# EasyEDA Pro project 超级电容组.epro

# Schematic 17.7V超级电容组
Board Name: 17.7V超级电容组; Create Date: 2025-03-22; Page Name: P1; Project Name: 超级电容组（螺丝孔扩大）; Schematic Name: 17.7V超级电容组; Update Date: 2025-04-11; Company: 嘉立创EDA; Page Size: A4; Version: V1.0
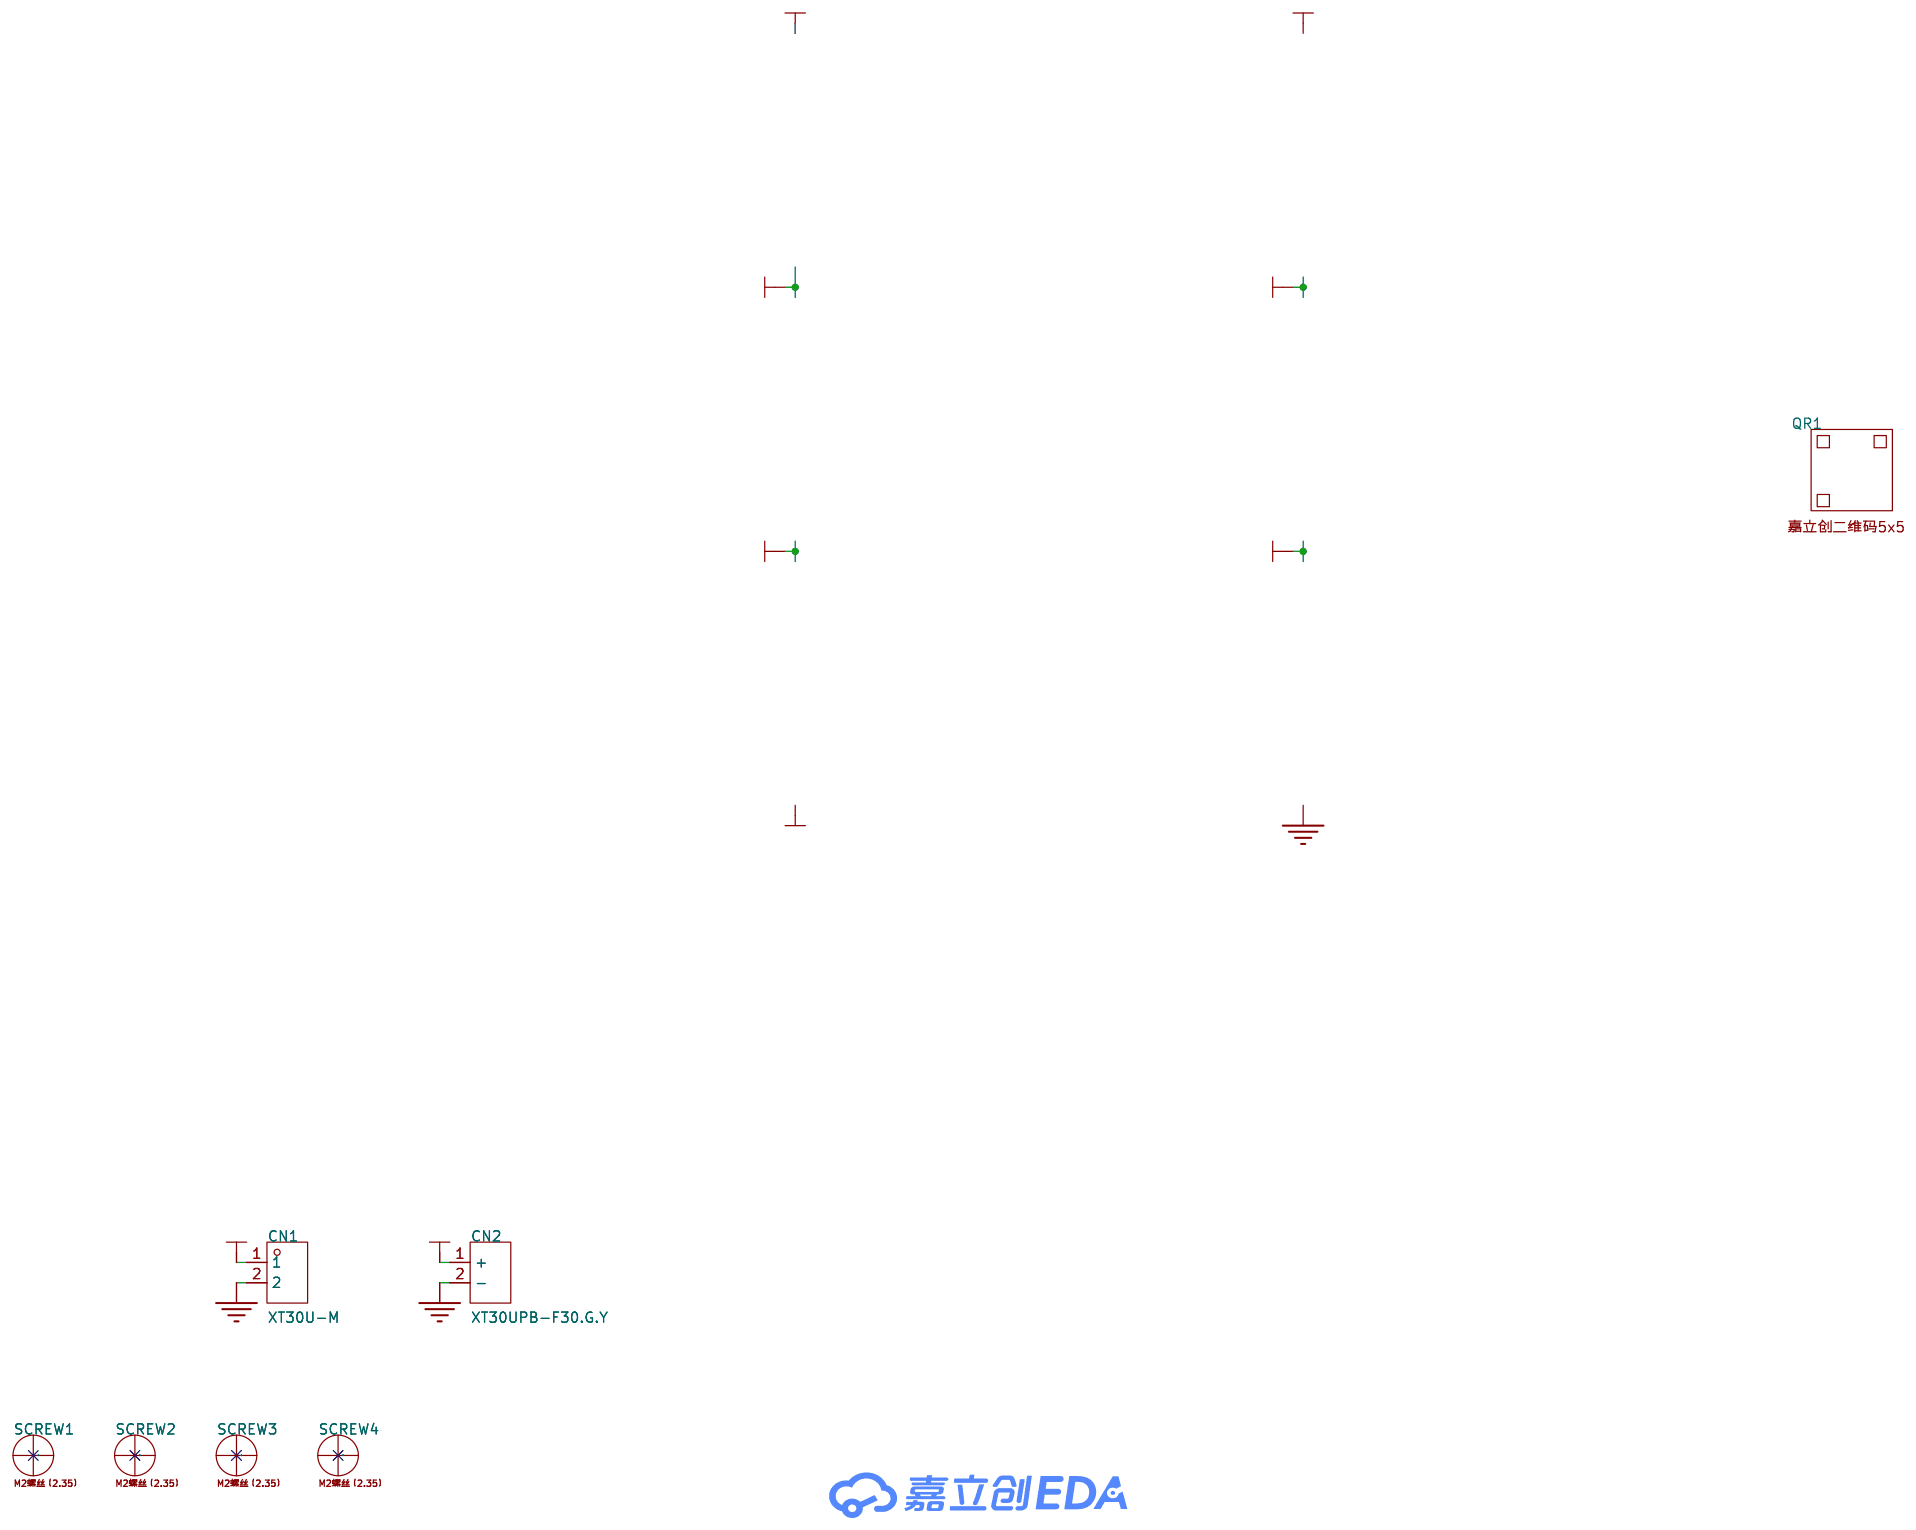
[diagram p0: schematic sheet]

## Parts
CBB1  -
CBB2  -
CBB3  -
CBB4  -
CBB5  -
CBB6  -
CN1  XT30U-M  [CONN-TH_XT30U-M]
CN2  XT30UPB-F30.G.Y  [CONN-TH_XT30UPB-F]
QR1  -  [JLC-QRCODE-5x5]
SCREW1  -  [M2螺丝（2.35）]
SCREW2  -  [M2螺丝（2.35）]
SCREW3  -  [M2螺丝（2.35）]
SCREW4  -  [M2螺丝（2.35）]

## Library data of the parts
CN1 = XT30U-M: 类别:-;类型1:-;; LCSC Part Name: AMASS(艾迈斯)轻量版锂电池插头公头 XT30U-M; Supplier Part: C99101; Manufacturer: AMASS(艾迈斯); Datasheet: https://atta.szlcsc.com/upload/public/pdf/source/20170606/1496716542582.pdf; Supplier: LCSC; Brand: 艾迈斯; Type: 插头; Colour: 黄色; InterfaceType: 公头
CN2 = XT30UPB-F30.G.Y: 类别:-;类型1:-;; LCSC Part Name: AMASS(艾迈斯)直立焊板式连接器XT30UPB30-F.G.*; Supplier Part: C108769; Manufacturer: AMASS(艾迈斯); JLCPCB Part Class: Extended Part; Datasheet: https://atta.szlcsc.com/upload/public/pdf/source/20220715/AFD68B9E8B6CA95A7295DBF4AF9325E4.pdf; Supplier: LCSC; Brand: 艾迈斯; Type: 航模插头; Colour: 黄色; RatedVoltage: DC 500V; InterfaceType: 母头; MetalMaterial: 镀金; InsulationMaterial: PA; RatedCurrent: 15A; contact resistance: 0.65mΩ
QR1 = 嘉立创二维码5x5: Check: false
SCREW1-SCREW4 = M2螺丝（2.35）

## Nets
GND: CBB6.2(GND) CN1.2 CN2.2(-)
VCAP1: CBB1.1(VCAP) CN1.1 CN2.1(+)
VCAP2: CBB1.2(GND) CBB2.1(VCAP)
VCAP3: CBB2.2(GND) CBB3.1(VCAP)
VCAP4: CBB3.2(GND) CBB4.1(VCAP)
VCAP5: CBB4.2(GND) CBB5.1(VCAP)
VCAP6: CBB5.2(GND) CBB6.1(VCAP)

Not connected (* = marked no-connect by the designer): SCREW1 1*; SCREW2 1*; SCREW3 1*; SCREW4 1*

# Schematic 50F-3V超级电容
Board Name: 50F-3V超级电容; Create Date: 2025-03-31; Page Name: P1; Project Name: 50F-3V超级电容; Schematic Name: 50F-3V超级电容; Update Date: 2025-03-31; Company: 嘉立创EDA; Page Size: A4; Version: V1.0
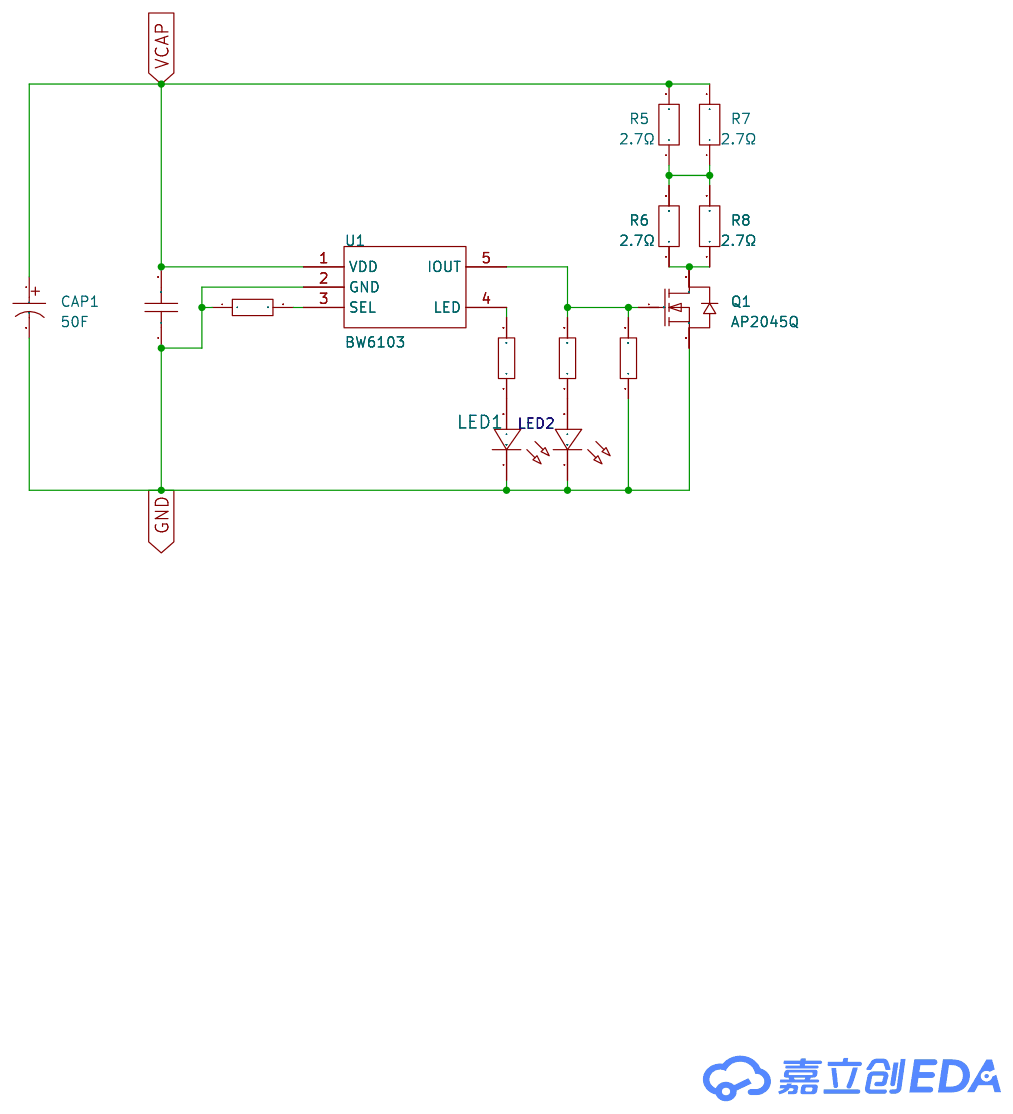
[diagram p1: schematic sheet]

## Parts
C1  1uF  [C0603]
CAP1  50F  [CAP-TH_BD18.0-P7.50-D1.2-FD]
LED1  XL-1608SURC-06  [LED_0603]
LED2  XL-1608UBC-04  [LED_0603]
Q1  AP2045Q  [DFN-8_L3.1-W3.0-P0.65-LS3.3-BL]
R1  1kΩ  [R0603]
R2  1kΩ  [R0603]
R3  1kΩ  [R0603]
R4  1kΩ  [R0603]
R5  2.7Ω  [R1206]
R6  2.7Ω  [R1206]
R7  2.7Ω  [R1206]
R8  2.7Ω  [R1206]
U1  BW6103  [SOT23-5]

## Library data of the parts
C1 = CL10A105KB8NNNC: 容值:1uF;精度:±10%;额定电压:50V;材质(温度系数):X5R;; LCSC Part Name: 1uF ±10% 50V; Supplier Part: C15849; Manufacturer: SAMSUNG(三星); Supplier Footprint: 0603; JLCPCB Part Class: Basic Part; Datasheet: https://atta.szlcsc.com/upload/public/pdf/source/20160218/1457707763339.pdf; Supplier: LCSC; Tolerance: ±10%; Voltage Rated: 50V; Temperature Coefficient: X5R
CAP1 = CXP-3R0506R-TW 3.0V50F: 容值:50F;精度:-10%~+30%;额定电压:3V;漏电流:75uA@72hrs;等效串联电阻(ESR):18mΩ@1kHz;; LCSC Part Name: 50F -10%~+30% 3V; Supplier Part: C2925898; Manufacturer: CDA(智烽维); Supplier Footprint: 插件,P=7.5mm; JLCPCB Part Class: Extended Part; Datasheet: https://atta.szlcsc.com/upload/public/pdf/source/20210903/44453F82BFAAA05FE6CCD2EFE8CDD582.pdf; Supplier: LCSC; Tolerance: -10%~+30%; Voltage Rating: 3V; Current - Leakage: 75uA@72hrs; Equivalent Series Resistance(ESR): 18mΩ@1kHz; Lifetime: 1000hrs@65℃; Operating Temperature: -40℃~+65℃; Diameter: 18mm; Height - Seated(Max): 40mm; Check: false
LED1 = XL-1608SURC-06: 灯头类型:-;发光颜色:红色;正向压降(Vf):2.3V;功率:50mW;正向电流:20mA;波长:620nm~630nm;二极管配置:-;透镜颜色:无色透明透镜;色温:-;发光强度:225mcd;发光角度:120°;载带方式:正贴;工作温度:-20℃~+85℃;; Supplier Part: C965799; Manufacturer: XINGLIGHT(成兴光); Supplier Footprint: 0603; JLCPCB Part Class: Extended Part; Datasheet: https://atta.szlcsc.com/upload/public/pdf/source/20250213/F9766CE804AF391355DCDD48DB3E0DAB.pdf; Supplier: LCSC; Illumination Color: 红色; Voltage - Forward(Vf): 2.3V; Power(Watts): 50mW; Forward Current: 20mA; Wavelength - Dominant: 620nm~630nm; Peak Wavelength: 625nm; Lens Color: 无色透明透镜; Luminous Intensity: 225mcd; Viewing Angle: 120°; Mounting Sytle: 正贴; Operating Temperature: -20℃~+85℃; Check: false
LED2 = XL-1608UBC-04: 灯头类型:-;发光颜色:蓝色;正向压降(Vf):3.3V;功率:70mW;正向电流:20mA;波长:455nm~475nm;二极管配置:-;透镜颜色:无色透明透镜;色温:-;发光强度:300mcd;发光角度:120°;载带方式:正贴;工作温度:-20℃~+85℃;; Supplier Part: C965807; Manufacturer: XINGLIGHT(成兴光); Supplier Footprint: 0603; JLCPCB Part Class: Extended Part; Datasheet: https://atta.szlcsc.com/upload/public/pdf/source/20250213/9D28F40E58C3285D8CA3C7212E2FBA3B.pdf; Supplier: LCSC; Illumination Color: 蓝色; Voltage - Forward(Vf): 3.3V; Power(Watts): 70mW; Forward Current: 20mA; Wavelength - Dominant: 455nm~475nm; Peak Wavelength: 470nm; Lens Color: 无色透明透镜; Luminous Intensity: 300mcd; Viewing Angle: 120°; Mounting Sytle: 正贴; Operating Temperature: -20℃~+85℃; Check: false
Q1 = AP2045Q: 类型:1个N沟道;漏源电压(Vdss):20V;连续漏极电流(Id):65A;导通电阻(RDS(on)@Vgs,Id):4.6mΩ@4.5V,20A;功率(Pd):35W;阈值电压(Vgs(th)@Id):600mV@1mA;; LCSC Part Name: N沟道,电流:65A,耐压:20V; Supplier Part: C2828594; Manufacturer: ALLPOWER(铨力); Supplier Footprint: DFN-8(3x3.1); Datasheet: https://atta.szlcsc.com/upload/public/pdf/source/20210507/C2828594_9C6148FF592D5F86F0D42008EBC9C631.pdf; Supplier: LCSC; Type: 1个N沟道; Drain Source Voltage (Vdss): 20V; Continuous Drain Current (Id): 65A; Drain Source On Resistance (RDS(on)@Vgs,Id): 4.6mΩ@4.5V,20A; Power Dissipation (Pd): 35W; Gate Threshold Voltage (Vgs(th)@Id): 600mV@1mA; Total Gate Charge (Qg@Vgs): 99.2nC; Input Capacitance (Ciss@Vds): 4.4nF; Reverse Transfer Capacitance (Crss@Vds): 400pF; Operating Temperature: -55℃~+150℃
R1-R4 = RC0603FR-071KL: 电阻类型:厚膜电阻;阻值:1kΩ;精度:±1%;功率:100mW;最大工作电压:75V;温度系数:±100ppm/℃;; LCSC Part Name: 厚膜电阻 1kΩ ±1% 100mW; Supplier Part: C22548; Manufacturer: YAGEO(国巨); Supplier Footprint: 0603; JLCPCB Part Class: Extended Part; Datasheet: https://atta.szlcsc.com/upload/public/pdf/source/20180316/70C0E2BDAE7FCC62C531A5A58D202EE1.pdf; Supplier: LCSC; Type: 厚膜电阻; Tolerance: ±1%; Power(Watts): 100mW; Overload Voltage (Max): 75V; Temperature Coefficient: ±100ppm/℃; Operating Temperature Range: -55℃~+155℃
R5-R8 = MFCR1206F2R70QHR: 电阻类型:薄膜电阻;阻值:2.7Ω;精度:±1%;工作电压:-;功率:1W;温度系数:±50ppm/℃;安装方式:贴片;; LCSC Part Name: 低阻薄膜采样电阻 2.7Ω ±1% 1W; Supplier Part: C42415573; Manufacturer: RESI(开步睿思); Supplier Footprint: 1206; Datasheet: https://atta.szlcsc.com/upload/public/pdf/source/20241216/C01C5DE37DA5B92A06CD9B33FDEFCA12.pdf; Supplier: LCSC; Type: 薄膜电阻; Tolerance: ±1%; Power(Watts): 1W; Temperature Coefficient: ±50ppm/℃; Mounting Type: 贴片
U1 = BW6101: Pin Type: IN; Check: false

## Nets
GND: C1.1 CAP1.2 LED1.1(C) LED2.1(C) Q1.1(S) Q1.2(S) Q1.3(S) R1.1 R4.1 U1.2(GND)
VCAP: C1.2 CAP1.1 R5.2 R7.2 U1.1(VDD)
$1N683: R1.2 U1.3(SEL)
$1N684: R2.2 U1.4(LED)
$1N687: LED1.2(A) R2.1
$1N688: LED2.2(A) R3.1
$1N689: Q1.4(G) R3.2 R4.2 U1.5(IOUT)
$1N690: R5.1 R6.2 R7.1 R8.2
$1N691: Q1.5(D) Q1.6(D) Q1.7(D) Q1.8(D) R6.1 R8.1

# Board 50F-3V超级电容
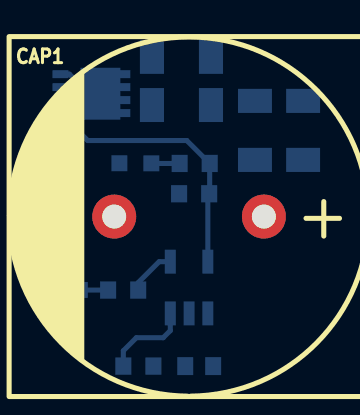
[diagram p2: board, top side]
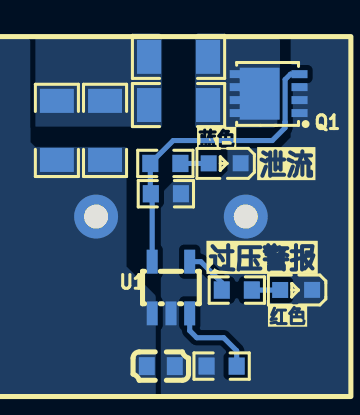
[diagram p3: board, bottom side, seen from below]

No outline. copper layers: Top Layer, Bottom Layer. Coordinates in mm from the lowest, leftmost part position.
Stack: Top Layer 0.035mm / Dielectric1 1.51mm FR4 er 4.5 / Bottom Layer 0.035mm

## Design rules (mm)
template: xyf_v1.1
spacing copperThickness1oz (default): track to track 0.102, other pairs 0.152 to 0.3
spacing copperThickness2oz: track to track 0.203, other pairs 0.152 to 0.3
spacing 0焊盘板框间距: track to track 0.152, other pairs 0 to 0.3
spacing copperThicknessInner0.5oz: track to track 0.089, other pairs 0.152 to 0.3
track width copperThickness1oz (default): min 0.127, default 0.254, max 2.54
track width copperThickness2oz: min 0.203, default 0.254, max 2.54
track width copperThickness0.5oz: min 0.089, default 0.254, max 2.54
differential pair differentialPair (default): width min 0.127, default 0.254, max 2.54; gap min 0.152, default 0.152
via viaSize (default): diameter min 0.5, default 0.61, max 10; hole min 0.3, default 0.305, max 6.3
via viaSize2: diameter min 0.5, default 0.61, max 10; hole min 0.3, default 0.305, max 6.299
via viaSize4: diameter min 0.45, default 0.61, max 10; hole min 0.3, default 0.305, max 6.299

## Placement (name value [footprint] x y rotation side)
C1  1uF  [C0603]  6.73 0 0 bottom
CAP1  50F  [CAP-TH_BD18.0-P7.50-D1.2-FD]  6.22 7.49 180 top
LED1  XL-1608SURC-06  [LED_0603]  0 3.81 0 bottom
LED2  XL-1608UBC-04  [LED_0603]  3.58 10.16 0 bottom
Q1  AP2045Q  [DFN-8_L3.1-W3.0-P0.65-LS3.3-BL]  1.33 13.65 90 bottom
R1  1kΩ  [R0603]  3.68 0 180 bottom
R2  1kΩ  [R0603]  2.92 3.81 0 bottom
R3  1kΩ  [R0603]  6.5 10.16 0 bottom
R4  1kΩ  [R0603]  6.48 8.64 0 bottom
R5  2.7Ω  [R1206]  9.53 11.81 270 bottom
R6  2.7Ω  [R1206]  5.84 13.08 0 bottom
R7  2.7Ω  [R1206]  11.94 11.81 270 bottom
R8  2.7Ω  [R1206]  5.84 15.49 0 bottom
U1  BW6103  [SOT23-5]  6.22 3.94 180 bottom

## Footprints (pads in the part's own frame, mm; a bottom-side part is the same pattern mirrored in y, then rotated)
C0603
  rect 0.8x0.9 smd: 1(-0.7,0) 2(0.7,0)
CAP-TH_BD18.0-P7.50-D1.2-FD
  round 2.2 hole 1.2: 1(-3.75,0) 2(3.75,0)
DFN-8_L3.1-W3.0-P0.65-LS3.3-BL
  rect 0.4x0.8 smd: 1(-0.975,-1.55) 2(-0.325,-1.55) 3(0.326,-1.55) 4(0.975,-1.55) 5(0.975,1.55) 6(0.325,1.55) 7(-0.325,1.55) 8(-0.975,1.55)
  rect 2.6x2 smd: 8(-0.004,0.45)
LED_0603
  rect 0.8x0.8 smd: 1(-0.851,-0.01) 2(0.75,-0.005)
R0603
  rect 0.806x0.864 smd: 1(-0.753,0) 2(0.753,0)
R1206
  rect 1.208x1.701 smd: 1(-1.479,0) 2(1.479,0)
SOT23-5
  rect 0.551x1.199 smd: 1(-0.94,-1.296) 2(0,-1.296) 3(0.94,-1.296) 4(0.94,1.296) 5(-0.94,1.296)

## Nets
As in the schematic.

## Routing (per net, layer and track width the routed paths; a pad name or vN(x,y) marks a point on that pad's centre or on a via; arc(x,y) is an arc through that point)
$1N683: length 4.4
  Bottom Layer w0.254: R1.2 2.93,0.77 3.58,1.42 4.93,1.42 5.28,1.78 U1.3
$1N684: length 2.4
  Bottom Layer w0.254: R2.2 3.67,4.18 4.72,5.23 U1.4
$1N687: length 1.4
  Bottom Layer w0.254: R2.1 0.75,3.81 LED1.2
$1N688: length 1.4
  Bottom Layer w0.254: R3.1 4.34,10.16 LED2.2
$1N689: length 15.7
  Bottom Layer w0.254: Q1.4 0.23,14.63 0.5,14.36 0.5,12.23 0.51,12.23 0.51,11.94 1.14,11.3 6.11,11.3 7.26,10.16 7.26,8.66 R4.2 7.16,8.57 U1.5

## Copper pours and planes (outline as drawn; the poured copper is in the pictures)
GND on Bottom Layer: 6.73,8.63 6.73,-1.47 -2.79,-1.47 -2.79,16.48 0.23,16.48 0.23,11.46 0.76,10.92 3.39,10.92 3.39,9.79 3.77,9.41 5.96,9.41
VCAP on Bottom Layer: 8.45,10.99 13.02,10.99 13.26,11.23 13.26,16.38 15.24,16.38 15.24,-1.52 6.99,-1.52 6.99,3.53 8.45,4.99
$1N690 on Bottom Layer: 6.67,16.45 13.02,16.45 13.02,12 6.67,12
$1N691 on Bottom Layer: 0.76,16.45 5.02,16.45 5.02,11.94 0.76,11.94

## Text on the board
Bottom Silkscreen Layer: 红色 | 蓝色 | 泄流 | 过压警报

# Board 17.7V超级电容组
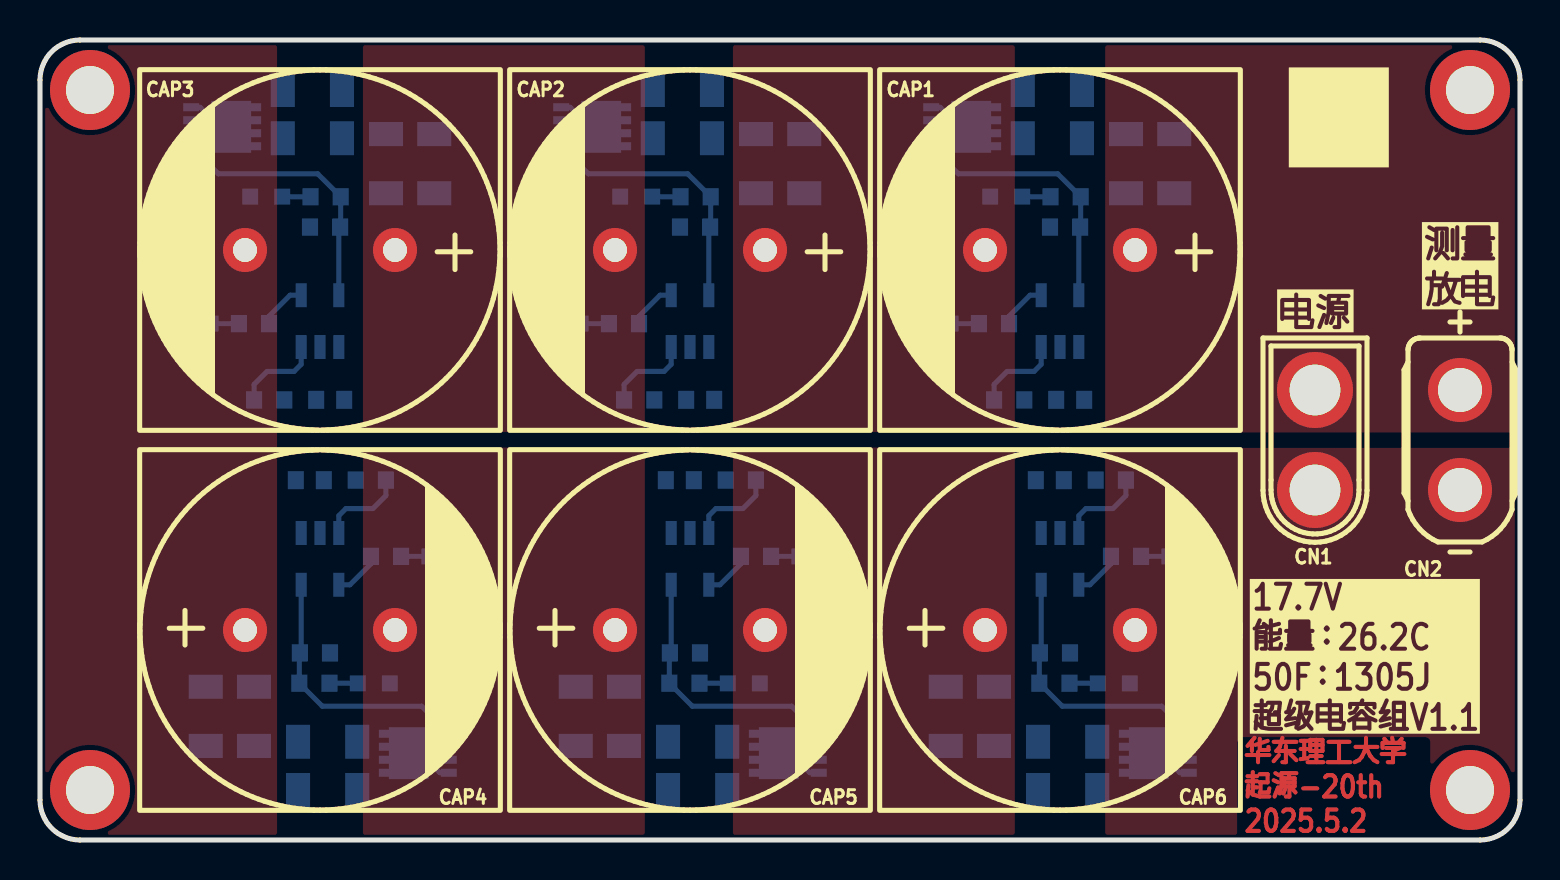
[diagram p4: board, top side]
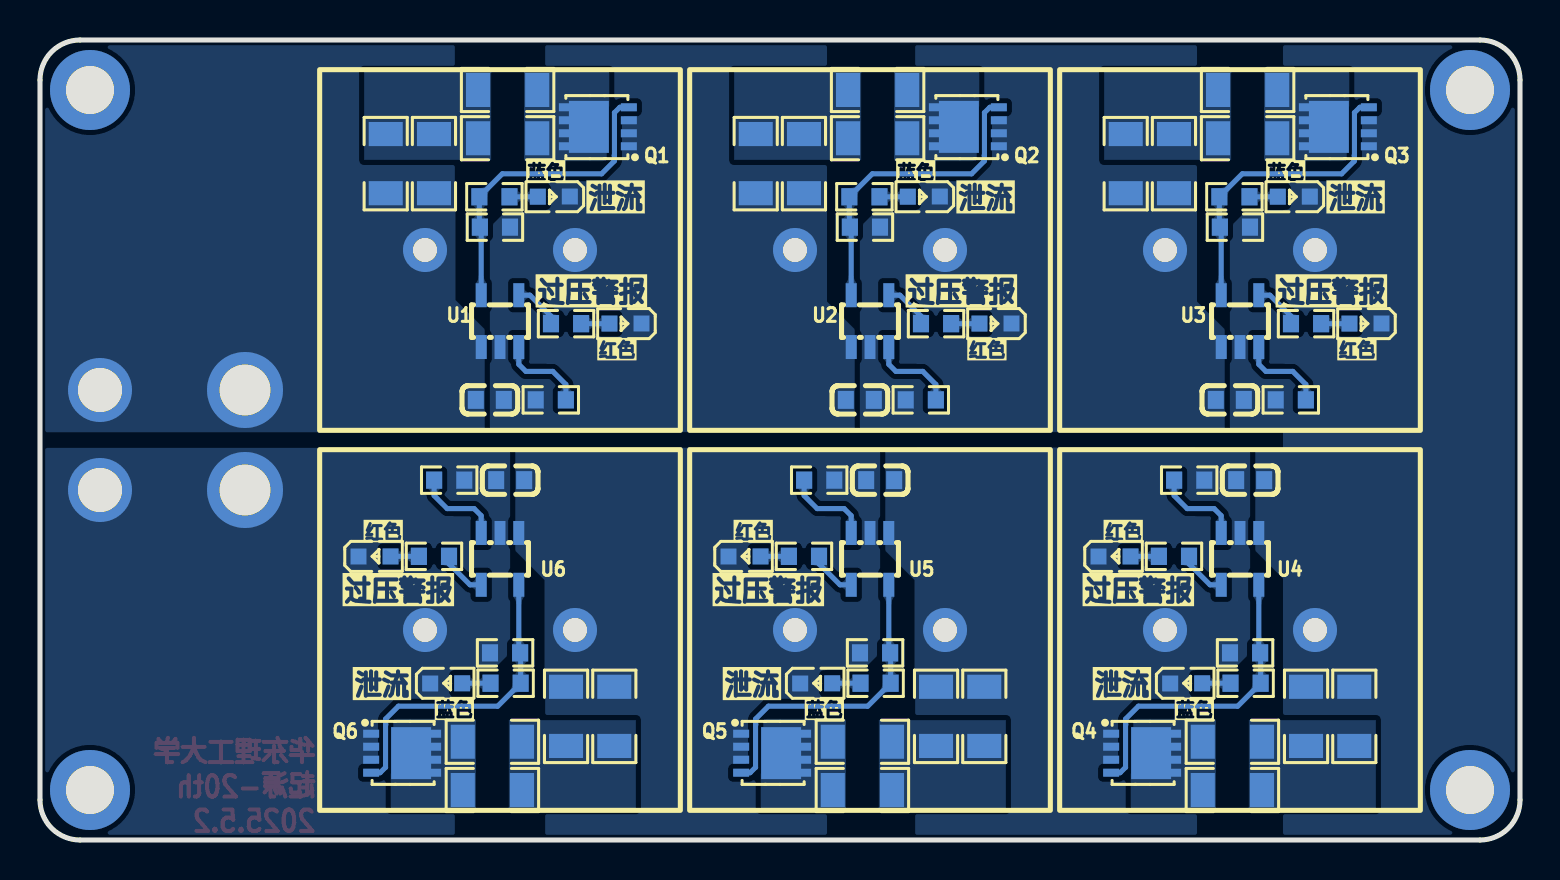
[diagram p5: board, bottom side, seen from below]

Outline 74 x 40 mm; copper layers: Top Layer, Bottom Layer. Coordinates in mm from the lower left corner of the outline.
Outline path: 0,38 0,2 arc(0.59,0.59) 2,0 72,0 arc(73.41,0.59) 74,2 74,38 arc(73.41,39.41) 72,40 2,40 arc(0.59,39.41) 0,38
Stack: Top Layer 0.035mm / Dielectric1 1.51mm FR4 er 4.5 / Bottom Layer 0.035mm

## Design rules (mm)
template: xyf_v1.1
spacing copperThickness1oz (default): track to track 0.102, other pairs 0.152 to 0.3
spacing copperThickness2oz: track to track 0.203, other pairs 0.152 to 0.3
spacing 0焊盘板框间距: track to track 0.152, other pairs 0 to 0.3
spacing copperThicknessInner0.5oz: track to track 0.089, other pairs 0.152 to 0.3
track width copperThickness1oz (default): min 0.127, default 0.254, max 2.54
track width copperThickness2oz: min 0.203, default 0.254, max 2.54
track width copperThickness0.5oz: min 0.089, default 0.254, max 2.54
differential pair differentialPair (default): width min 0.127, default 0.254, max 2.54; gap min 0.152, default 0.152
via viaSize (default): diameter min 0.5, default 0.61, max 10; hole min 0.3, default 0.305, max 6.3
via viaSize2: diameter min 0.5, default 0.61, max 10; hole min 0.3, default 0.305, max 6.299
via viaSize4: diameter min 0.45, default 0.61, max 10; hole min 0.3, default 0.305, max 6.299

## Placement (name value [footprint] x y rotation side)
C1  1uF  [C0603]  51.51 22.01 0 bottom
C2  1uF  [C0603]  33.01 22.01 0 bottom
C3  1uF  [C0603]  14.51 22.01 0 bottom
C4  1uF  [C0603]  13.49 17.99 180 bottom
C5  1uF  [C0603]  31.99 17.99 180 bottom
C6  1uF  [C0603]  50.49 17.99 180 bottom
CAP1  50F  [CAP-TH_BD18.0-P7.50-D1.2-FD]  51 29.5 180 top
CAP2  50F  [CAP-TH_BD18.0-P7.50-D1.2-FD]  32.5 29.5 180 top
CAP3  50F  [CAP-TH_BD18.0-P7.50-D1.2-FD]  14 29.5 180 top
CAP4  50F  [CAP-TH_BD18.0-P7.50-D1.2-FD]  14 10.5 0 top
CAP5  50F  [CAP-TH_BD18.0-P7.50-D1.2-FD]  32.5 10.5 0 top
CAP6  50F  [CAP-TH_BD18.0-P7.50-D1.2-FD]  51 10.5 0 top
CN1  XT30U-M  [CONN-TH_XT30U-M]  63.75 20 270 top
CN2  XT30UPB-F30.G.Y  [CONN-TH_XT30UPB-F]  71 20 270 top
LED1  XL-1608SURC-06  [LED_0603]  44.78 25.82 0 bottom
LED2  XL-1608UBC-04  [LED_0603]  48.36 32.16 0 bottom
LED3  XL-1608SURC-06  [LED_0603]  26.28 25.82 0 bottom
LED4  XL-1608UBC-04  [LED_0603]  29.86 32.16 0 bottom
LED5  XL-1608SURC-06  [LED_0603]  7.78 25.82 0 bottom
LED6  XL-1608UBC-04  [LED_0603]  11.36 32.16 0 bottom
LED7  XL-1608SURC-06  [LED_0603]  20.22 14.18 180 bottom
LED8  XL-1608UBC-04  [LED_0603]  16.64 7.84 180 bottom
LED9  XL-1608SURC-06  [LED_0603]  38.72 14.18 180 bottom
LED10  XL-1608UBC-04  [LED_0603]  35.14 7.84 180 bottom
LED11  XL-1608SURC-06  [LED_0603]  57.22 14.18 180 bottom
LED12  XL-1608UBC-04  [LED_0603]  53.64 7.84 180 bottom
Q1  AP2045Q  [DFN-8_L3.1-W3.0-P0.65-LS3.3-BL]  46.11 35.66 90 bottom
Q2  AP2045Q  [DFN-8_L3.1-W3.0-P0.65-LS3.3-BL]  27.61 35.66 90 bottom
Q3  AP2045Q  [DFN-8_L3.1-W3.0-P0.65-LS3.3-BL]  9.11 35.66 90 bottom
Q4  AP2045Q  [DFN-8_L3.1-W3.0-P0.65-LS3.3-BL]  18.89 4.34 270 bottom
Q5  AP2045Q  [DFN-8_L3.1-W3.0-P0.65-LS3.3-BL]  37.39 4.34 270 bottom
Q6  AP2045Q  [DFN-8_L3.1-W3.0-P0.65-LS3.3-BL]  55.89 4.34 270 bottom
QR1  -  [JLC-QRCODE-5x5]  64.94 36.13 0 top
R1  1kΩ  [R0603]  48.46 22.01 180 bottom
R2  1kΩ  [R0603]  47.7 25.82 0 bottom
R3  1kΩ  [R0603]  51.28 32.16 0 bottom
R4  1kΩ  [R0603]  51.25 30.64 0 bottom
R5  2.7Ω  [R1206]  54.3 33.82 270 bottom
R6  2.7Ω  [R1206]  50.62 35.09 0 bottom
R7  2.7Ω  [R1206]  56.72 33.82 270 bottom
R8  2.7Ω  [R1206]  50.62 37.5 0 bottom
R9  1kΩ  [R0603]  29.96 22.01 180 bottom
R10  1kΩ  [R0603]  29.2 25.82 0 bottom
R11  1kΩ  [R0603]  32.78 32.16 0 bottom
R12  1kΩ  [R0603]  32.75 30.64 0 bottom
R13  2.7Ω  [R1206]  35.8 33.82 270 bottom
R14  2.7Ω  [R1206]  32.12 35.09 0 bottom
R15  2.7Ω  [R1206]  38.22 33.82 270 bottom
R16  2.7Ω  [R1206]  32.12 37.5 0 bottom
R17  1kΩ  [R0603]  11.46 22.01 180 bottom
R18  1kΩ  [R0603]  10.7 25.82 0 bottom
R19  1kΩ  [R0603]  14.28 32.16 0 bottom
R20  1kΩ  [R0603]  14.25 30.64 0 bottom
R21  2.7Ω  [R1206]  17.3 33.82 270 bottom
R22  2.7Ω  [R1206]  13.62 35.09 0 bottom
R23  2.7Ω  [R1206]  19.72 33.82 270 bottom
R24  2.7Ω  [R1206]  13.62 37.5 0 bottom
R25  1kΩ  [R0603]  16.54 17.99 0 bottom
R26  1kΩ  [R0603]  17.3 14.18 180 bottom
R27  1kΩ  [R0603]  13.72 7.84 180 bottom
R28  1kΩ  [R0603]  13.75 9.36 180 bottom
R29  2.7Ω  [R1206]  10.7 6.18 90 bottom
R30  2.7Ω  [R1206]  14.38 4.91 180 bottom
R31  2.7Ω  [R1206]  8.28 6.18 90 bottom
R32  2.7Ω  [R1206]  14.38 2.5 180 bottom
R33  1kΩ  [R0603]  35.04 17.99 0 bottom
R34  1kΩ  [R0603]  35.8 14.18 180 bottom
R35  1kΩ  [R0603]  32.22 7.84 180 bottom
R36  1kΩ  [R0603]  32.25 9.36 180 bottom
R37  2.7Ω  [R1206]  29.2 6.18 90 bottom
R38  2.7Ω  [R1206]  32.88 4.91 180 bottom
R39  2.7Ω  [R1206]  26.78 6.18 90 bottom
R40  2.7Ω  [R1206]  32.88 2.5 180 bottom
R41  1kΩ  [R0603]  53.54 17.99 0 bottom
R42  1kΩ  [R0603]  54.3 14.18 180 bottom
R43  1kΩ  [R0603]  50.72 7.84 180 bottom
R44  1kΩ  [R0603]  50.75 9.36 180 bottom
R45  2.7Ω  [R1206]  47.7 6.18 90 bottom
R46  2.7Ω  [R1206]  51.38 4.91 180 bottom
R47  2.7Ω  [R1206]  45.28 6.18 90 bottom
R48  2.7Ω  [R1206]  51.38 2.5 180 bottom
SCREW1  -  [M2螺丝（2.35）]  2.5 37.5 0 top
SCREW2  -  [M2螺丝（2.35）]  71.5 37.5 0 top
SCREW3  -  [M2螺丝（2.35）]  2.5 2.5 0 top
SCREW4  -  [M2螺丝（2.35）]  71.5 2.5 0 top
U1  BW6103  [SOT23-5]  51 25.94 180 bottom
U2  BW6103  [SOT23-5]  32.5 25.94 180 bottom
U3  BW6103  [SOT23-5]  14 25.94 180 bottom
U4  BW6103  [SOT23-5]  14 14.06 0 bottom
U5  BW6103  [SOT23-5]  32.5 14.06 0 bottom
U6  BW6103  [SOT23-5]  51 14.06 0 bottom

## Footprints (pads in the part's own frame, mm; a bottom-side part is the same pattern mirrored in y, then rotated)
C0603
  rect 0.8x0.9 smd: 1(-0.7,0) 2(0.7,0)
CAP-TH_BD18.0-P7.50-D1.2-FD
  round 2.2 hole 1.2: 1(-3.75,0) 2(3.75,0)
CONN-TH_XT30U-M
  round 3.8 hole 2.54: 1(-2.5,0) 2(2.5,0)
CONN-TH_XT30UPB-F
  round 3.2 hole 2.2: 1(-2.5,0) 2(2.5,0)
DFN-8_L3.1-W3.0-P0.65-LS3.3-BL
  rect 0.4x0.8 smd: 1(-0.975,-1.55) 2(-0.325,-1.55) 3(0.326,-1.55) 4(0.975,-1.55) 5(0.975,1.55) 6(0.325,1.55) 7(-0.325,1.55) 8(-0.975,1.55)
  rect 2.6x2 smd: 8(-0.004,0.45)
LED_0603
  rect 0.8x0.8 smd: 1(-0.851,-0.01) 2(0.75,-0.005)
M2螺丝（2.35）
  round 4 hole 2.4x2.35: 1(0,0)
R0603
  rect 0.806x0.864 smd: 1(-0.753,0) 2(0.753,0)
R1206
  rect 1.208x1.701 smd: 1(-1.479,0) 2(1.479,0)
SOT23-5
  rect 0.551x1.199 smd: 1(-0.94,-1.296) 2(0,-1.296) 3(0.94,-1.296) 4(0.94,1.296) 5(-0.94,1.296)

## Nets
GND: C6.1 CAP6.2 CN1.2 CN2.2 LED11.1 LED12.1 Q6.1 Q6.2 Q6.3 R41.1 R44.1 U6.2
$1I13637\$1N683: R1.2 U1.3
$1I13637\$1N684: R2.2 U1.4
$1I13637\$1N687: LED1.2 R2.1
$1I13637\$1N688: LED2.2 R3.1
$1I13637\$1N689: Q1.4 R3.2 R4.2 U1.5
$1I13637\$1N690: R5.1 R6.2 R7.1 R8.2
$1I13637\$1N691: Q1.5 Q1.6 Q1.7 Q1.8 R6.1 R8.1
$1I13651\$1N683: R9.2 U2.3
$1I13651\$1N684: R10.2 U2.4
$1I13651\$1N687: LED3.2 R10.1
$1I13651\$1N688: LED4.2 R11.1
$1I13651\$1N689: Q2.4 R11.2 R12.2 U2.5
$1I13651\$1N690: R13.1 R14.2 R15.1 R16.2
$1I13651\$1N691: Q2.5 Q2.6 Q2.7 Q2.8 R14.1 R16.1
$1I13665\$1N683: R17.2 U3.3
$1I13665\$1N684: R18.2 U3.4
$1I13665\$1N687: LED5.2 R18.1
$1I13665\$1N688: LED6.2 R19.1
$1I13665\$1N689: Q3.4 R19.2 R20.2 U3.5
$1I13665\$1N690: R21.1 R22.2 R23.1 R24.2
$1I13665\$1N691: Q3.5 Q3.6 Q3.7 Q3.8 R22.1 R24.1
$1I13693\$1N683: R25.2 U4.3
$1I13693\$1N684: R26.2 U4.4
$1I13693\$1N687: LED7.2 R26.1
$1I13693\$1N688: LED8.2 R27.1
$1I13693\$1N689: Q4.4 R27.2 R28.2 U4.5
$1I13693\$1N690: R29.1 R30.2 R31.1 R32.2
$1I13693\$1N691: Q4.5 Q4.6 Q4.7 Q4.8 R30.1 R32.1
$1I13707\$1N683: R33.2 U5.3
$1I13707\$1N684: R34.2 U5.4
$1I13707\$1N687: LED9.2 R34.1
$1I13707\$1N688: LED10.2 R35.1
$1I13707\$1N689: Q5.4 R35.2 R36.2 U5.5
$1I13707\$1N690: R37.1 R38.2 R39.1 R40.2
$1I13707\$1N691: Q5.5 Q5.6 Q5.7 Q5.8 R38.1 R40.1
$1I13721\$1N683: R41.2 U6.3
$1I13721\$1N684: R42.2 U6.4
$1I13721\$1N687: LED11.2 R42.1
$1I13721\$1N688: LED12.2 R43.1
$1I13721\$1N689: Q6.4 R43.2 R44.2 U6.5
$1I13721\$1N690: R45.1 R46.2 R47.1 R48.2
$1I13721\$1N691: Q6.5 Q6.6 Q6.7 Q6.8 R46.1 R48.1
VCAP1: C1.2 CAP1.1 CN1.1 CN2.1 R5.2 R7.2 U1.1
VCAP2: C1.1 C2.2 CAP1.2 CAP2.1 LED1.1 LED2.1 Q1.1 Q1.2 Q1.3 R1.1 R4.1 R13.2 R15.2 U1.2 U2.1
VCAP3: C2.1 C3.2 CAP2.2 CAP3.1 LED3.1 LED4.1 Q2.1 Q2.2 Q2.3 R9.1 R12.1 R21.2 R23.2 U2.2 U3.1
VCAP4: C3.1 C4.2 CAP3.2 CAP4.1 LED5.1 LED6.1 Q3.1 Q3.2 Q3.3 R17.1 R20.1 R29.2 R31.2 U3.2 U4.1
VCAP5: C4.1 C5.2 CAP4.2 CAP5.1 LED7.1 LED8.1 Q4.1 Q4.2 Q4.3 R25.1 R28.1 R37.2 R39.2 U4.2 U5.1
VCAP6: C5.1 C6.2 CAP5.2 CAP6.1 LED9.1 LED10.1 Q5.1 Q5.2 Q5.3 R33.1 R36.1 R45.2 R47.2 U5.2 U6.1

Pads without a net: SCREW1 1; SCREW2 1; SCREW3 1; SCREW4 1

## Routing (per net, layer and track width the routed paths; a pad name or vN(x,y) marks a point on that pad's centre or on a via; arc(x,y) is an arc through that point)
$1I13637\$1N683: length 4.4
  Bottom Layer w0.254: R1.2 47.71,22.78 48.36,23.43 49.7,23.43 50.06,23.78 U1.3
$1I13637\$1N684: length 2.4
  Bottom Layer w0.254: R2.2 48.45,26.19 49.5,27.24 U1.4
$1I13637\$1N687: length 1.4
  Bottom Layer w0.254: LED1.2 45.53,25.82 R2.1
$1I13637\$1N688: length 1.4
  Bottom Layer w0.254: LED2.2 49.11,32.16 R3.1
$1I13637\$1N689: length 15.7
  Bottom Layer w0.254: U1.5 51.94,30.58 R4.2 52.03,30.67 52.03,32.16 50.88,33.31 45.92,33.31 45.28,33.94 45.28,34.23 45.28,34.24 45.28,36.37 45.01,36.64 Q1.4
$1I13651\$1N683: length 4.4
  Bottom Layer w0.254: R9.2 29.21,22.78 29.86,23.43 31.2,23.43 31.56,23.78 U2.3
$1I13651\$1N684: length 2.4
  Bottom Layer w0.254: R10.2 29.95,26.19 31,27.24 U2.4
$1I13651\$1N687: length 1.4
  Bottom Layer w0.254: R10.1 27.03,25.82 LED3.2
$1I13651\$1N688: length 1.4
  Bottom Layer w0.254: R11.1 30.61,32.16 LED4.2
$1I13651\$1N689: length 15.7
  Bottom Layer w0.254: U2.5 33.44,30.58 R12.2 33.53,30.67 33.53,32.16 32.38,33.31 27.42,33.31 26.78,33.94 26.78,34.23 26.78,34.24 26.78,36.37 26.51,36.64 Q2.4
$1I13665\$1N683: length 4.4
  Bottom Layer w0.254: U3.3 13.06,23.78 12.7,23.43 11.36,23.43 10.71,22.78 R17.2
$1I13665\$1N684: length 2.4
  Bottom Layer w0.254: U3.4 12.5,27.24 11.45,26.19 R18.2
$1I13665\$1N687: length 1.4
  Bottom Layer w0.254: R18.1 8.53,25.82 LED5.2
$1I13665\$1N688: length 1.4
  Bottom Layer w0.254: LED6.2 12.11,32.16 R19.1
$1I13665\$1N689: length 15.7
  Bottom Layer w0.254: U3.5 14.94,30.58 R20.2 15.03,30.67 15.03,32.16 13.89,33.31 8.92,33.31 8.28,33.94 8.28,34.23 8.28,34.24 8.28,36.37 8.01,36.64 Q3.4
$1I13693\$1N683: length 4.4
  Bottom Layer w0.254: R25.2 17.29,17.22 16.64,16.57 15.3,16.57 14.94,16.22 U4.3
$1I13693\$1N684: length 2.4
  Bottom Layer w0.254: U4.4 15.5,12.76 16.55,13.81 R26.2
$1I13693\$1N687: length 1.4
  Bottom Layer w0.254: R26.1 19.47,14.18 LED7.2
$1I13693\$1N688: length 1.4
  Bottom Layer w0.254: R27.1 15.89,7.84 LED8.2
$1I13693\$1N689: length 15.7
  Bottom Layer w0.254: U4.5 13.06,9.42 R28.2 12.97,9.33 12.97,7.84 14.11,6.69 19.08,6.69 19.72,6.06 19.72,5.77 19.72,5.76 19.72,3.63 19.99,3.36 Q4.4
$1I13707\$1N683: length 4.4
  Bottom Layer w0.254: U5.3 33.44,16.22 33.8,16.57 35.14,16.57 35.79,17.22 R33.2
$1I13707\$1N684: length 2.4
  Bottom Layer w0.254: R34.2 35.05,13.81 34,12.76 U5.4
$1I13707\$1N687: length 1.4
  Bottom Layer w0.254: LED9.2 37.97,14.18 R34.1
$1I13707\$1N688: length 1.4
  Bottom Layer w0.254: R35.1 34.39,7.84 LED10.2
$1I13707\$1N689: length 15.7
  Bottom Layer w0.254: U5.5 31.56,9.42 R36.2 31.47,9.33 31.47,7.84 32.62,6.69 37.58,6.69 38.22,6.06 38.22,5.77 38.22,5.76 38.22,3.63 38.49,3.36 Q5.4
$1I13721\$1N683: length 4.4
  Bottom Layer w0.254: R41.2 54.29,17.22 53.64,16.57 52.3,16.57 51.94,16.22 U6.3
$1I13721\$1N684: length 2.4
  Bottom Layer w0.254: U6.4 52.5,12.76 53.55,13.81 R42.2
$1I13721\$1N687: length 1.4
  Bottom Layer w0.254: LED11.2 56.47,14.18 R42.1
$1I13721\$1N688: length 1.4
  Bottom Layer w0.254: LED12.2 52.89,7.84 R43.1
$1I13721\$1N689: length 15.7
  Bottom Layer w0.254: U6.5 50.06,9.42 R44.2 49.97,9.33 49.97,7.84 51.12,6.69 56.08,6.69 56.72,6.06 56.72,5.77 56.72,5.76 56.72,3.63 56.99,3.36 Q6.4

## Copper pours and planes (outline as drawn; the poured copper is in the pictures)
GND on Top Layer: 74.97,-0.46 53.26,-0.46 53.26,19.61 74.97,19.61
GND on Bottom Layer: 74.97,-0.46 53.26,-0.46 53.26,19.61 74.97,19.61
GND on Bottom Layer: 50.49,9.36 50.49,19.47 60.02,19.47 60.02,1.51 57,1.51 57,6.54 56.46,7.07 53.83,7.07 53.83,8.21 53.45,8.59 51.26,8.59
$1I13637\$1N690 on Bottom Layer: 51.44,38.45 57.79,38.45 57.79,34.01 51.44,34.01
$1I13637\$1N691 on Bottom Layer: 45.54,38.45 49.79,38.45 49.79,33.94 45.54,33.94
$1I13651\$1N690 on Bottom Layer: 32.94,38.45 39.29,38.45 39.29,34.01 32.94,34.01
$1I13651\$1N691 on Bottom Layer: 27.04,38.45 31.29,38.45 31.29,33.94 27.04,33.94
$1I13665\$1N690 on Bottom Layer: 14.44,38.45 20.79,38.45 20.79,34.01 14.44,34.01
$1I13665\$1N691 on Bottom Layer: 8.54,38.45 12.8,38.45 12.8,33.94 8.54,33.94
$1I13693\$1N690 on Bottom Layer: 7.21,5.99 13.56,5.99 13.56,1.55 7.21,1.55
$1I13693\$1N691 on Bottom Layer: 19.46,1.55 15.21,1.55 15.21,6.06 19.46,6.06
$1I13707\$1N690 on Bottom Layer: 25.71,5.99 32.06,5.99 32.06,1.55 25.71,1.55
$1I13707\$1N691 on Bottom Layer: 37.96,1.55 33.71,1.55 33.71,6.06 37.96,6.06
$1I13721\$1N690 on Bottom Layer: 44.21,5.99 50.56,5.99 50.56,1.55 44.21,1.55
$1I13721\$1N691 on Bottom Layer: 56.46,1.55 52.21,1.55 52.21,6.06 56.46,6.06
VCAP1 on Top Layer: 53.26,40.45 74.97,40.45 74.97,20.38 53.26,20.38
VCAP1 on Bottom Layer: 53.26,40.45 74.97,40.45 74.97,20.38 53.26,20.38
VCAP1 on Bottom Layer: 53.22,32.99 57.79,32.99 58.03,33.23 58.03,38.39 60.02,38.39 60.02,20.48 51.76,20.48 51.76,25.54 53.22,27
VCAP2 on Top Layer: 34.65,40.46 48.74,40.46 48.74,20.39 34.65,20.39
VCAP2 on Bottom Layer: 51.51,30.64 51.51,20.53 41.98,20.53 41.98,38.49 45,38.49 45,33.46 45.54,32.93 48.17,32.93 48.17,31.79 48.55,31.41 50.74,31.41
VCAP2 on Bottom Layer: 34.65,40.46 48.74,40.46 48.74,20.39 34.65,20.39
VCAP2 on Bottom Layer: 34.72,32.99 39.29,32.99 39.53,33.23 39.53,38.39 41.52,38.39 41.52,20.48 33.26,20.48 33.26,25.54 34.72,27
VCAP3 on Top Layer: 16.15,40.46 30.24,40.46 30.24,20.39 16.15,20.39
VCAP3 on Bottom Layer: 16.22,32.99 20.79,32.99 21.03,33.23 21.03,38.39 23.02,38.39 23.02,20.48 14.76,20.48 14.76,25.54 16.22,27
VCAP3 on Bottom Layer: 33.01,30.64 33.01,20.53 23.48,20.53 23.48,38.49 26.5,38.49 26.5,33.46 27.04,32.93 29.67,32.93 29.67,31.79 30.05,31.41 32.24,31.41
VCAP3 on Bottom Layer: 16.15,40.46 30.24,40.46 30.24,20.39 16.15,20.39
VCAP4 on Top Layer: -1.86,41.97 11.85,41.97 11.85,-2.22 -1.86,-2.22
VCAP4 on Bottom Layer: 14.51,30.64 14.51,20.53 4.98,20.53 4.98,38.49 8,38.49 8,33.46 8.54,32.93 11.17,32.93 11.17,31.79 11.55,31.41 13.74,31.41
VCAP4 on Bottom Layer: 11.78,7.01 7.21,7.01 6.97,6.77 6.97,1.61 4.98,1.61 4.98,19.52 13.24,19.52 13.24,14.46 11.78,13
VCAP4 on Bottom Layer: -1.86,41.97 11.85,41.97 11.85,-2.22 -1.86,-2.22
VCAP5 on Top Layer: 30.24,-0.45 16.15,-0.45 16.15,19.62 30.24,19.62
VCAP5 on Bottom Layer: 13.49,9.36 13.49,19.47 23.02,19.47 23.02,1.51 20,1.51 20,6.54 19.46,7.07 16.83,7.07 16.83,8.21 16.45,8.59 14.26,8.59
VCAP5 on Bottom Layer: 30.24,-0.45 16.15,-0.45 16.15,19.62 30.24,19.62
VCAP5 on Bottom Layer: 30.28,7.01 25.71,7.01 25.47,6.77 25.47,1.61 23.48,1.61 23.48,19.52 31.74,19.52 31.74,14.46 30.28,13
VCAP6 on Top Layer: 48.74,-0.45 34.65,-0.45 34.65,19.62 48.74,19.62
VCAP6 on Bottom Layer: 48.74,-0.45 34.65,-0.45 34.65,19.62 48.74,19.62
VCAP6 on Bottom Layer: 48.78,7.01 44.21,7.01 43.97,6.77 43.97,1.61 41.98,1.61 41.98,19.52 50.24,19.52 50.24,14.46 48.78,13
VCAP6 on Bottom Layer: 31.99,9.36 31.99,19.47 41.52,19.47 41.52,1.51 38.5,1.51 38.5,6.54 37.96,7.07 35.33,7.07 35.33,8.21 34.95,8.59 32.76,8.59

Small or netless copper shapes (teardrops, artwork), in the pictures only: 84 on Bottom Layer

## Text on the board
Bottom Silkscreen Layer: 红色 | 蓝色 | 泄流 | 过压警报
Top Layer: 华东理工大学 / 起源-20th / 2025.5.2
Top Silkscreen Layer: 17.7V / 能量：26.2C / 50F：1305J / 超级电容组V1.1 | 电源 | 测量 / 放电
